# EAGLE schematic distance (EAGLE 7.5.0)
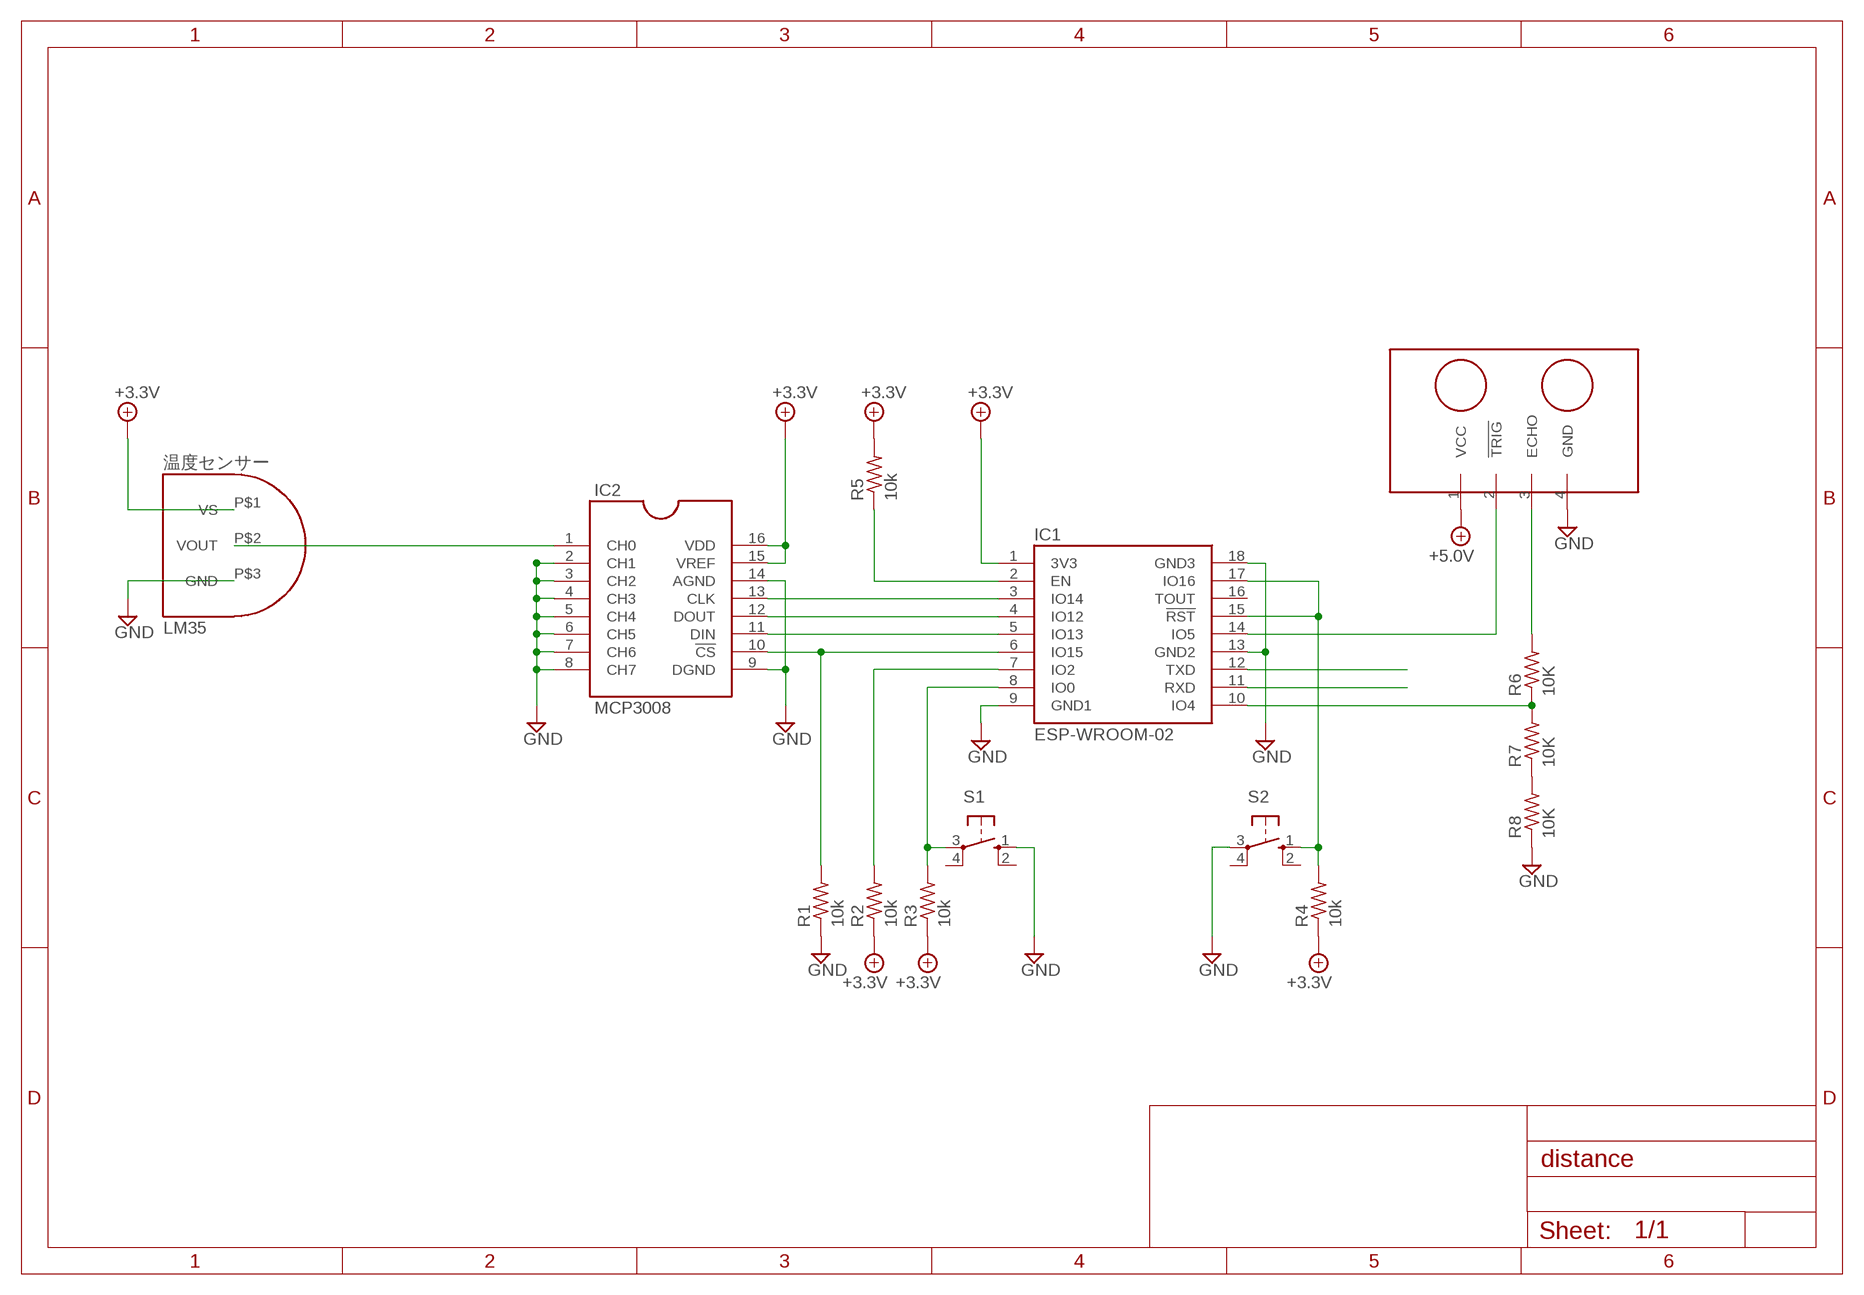
[diagram p0: schematic, sheet 1]

## Parts
IC1  ESP-WROOM-02  [WROOM-02]
IC2  MCP3008  [DIL16]
R1  10k  R  [0309/12]
R2  10k  R  [0309/12]
R3  10k  R  [0309/12]
R4  10k  R  [0309/12]
R5  10k  R  [0309/12]
R6  10K  R  [0309/12]
R7  10K  R  [0309/12]
R8  10K  R  [0309/12]
S1  10-XX(タクトスイッチ)  [B3F-10XX]
S2  10-XX(タクトスイッチ)  [B3F-10XX]
U$1  HC-SR04(距離センサー)  [HC-SR04(距離センサー)]
温度センサー  LM35  [LM35]

## Nets
+3.3V: IC1.1(3V3) IC2.15(VREF) IC2.16(VDD) R2.1 R3.1 R4.1 R5.2 U$1.1(VCC) 温度センサー.P$1(VS) ; supply symbol labelled +5.0V
GND: IC1.9(GND1) IC1.13(GND2) IC1.18(GND3) IC2.2(CH1) IC2.3(CH2) IC2.4(CH3) IC2.5(CH4) IC2.6(CH5) IC2.7(CH6) IC2.8(CH7) IC2.9(DGND) IC2.14(AGND) R1.1 R8.1 S1.1(S) S2.3(P) U$1.4(GND) 温度センサー.P$3(GND)
N$1: IC1.6(IO15) IC2.10(!CS!) R1.2
N$2: IC1.5(IO13) IC2.11(DIN)
N$3: IC1.4(IO12) IC2.12(DOUT)
N$4: IC1.15(!RST!) IC1.17(IO16) R4.2 S2.1(S)
N$5: IC1.7(IO2) R2.2
N$7: IC1.12(TXD)
N$8: IC1.3(IO14) IC2.13(CLK)
N$9: IC1.11(RXD)
N$10: IC1.8(IO0) R3.2 S1.3(P)
N$11: IC2.1(CH0) 温度センサー.P$2(VOUT)
N$15: IC1.2(EN) R5.1
N$16: IC1.14(IO5) U$1.2(!TRIG!)
N$17: R7.1 R8.2
N$18: R6.2 U$1.3(ECHO)
R6: IC1.10(IO4) R6.1 R7.2
Unconnected: IC1.16(TOUT) S1.2(S1) S1.4(P1) S2.2(S1) S2.4(P1)

## Library data of the parts
IC1 = MyLibraries:ESP-WROOM-02: ESP8266 WROOM-02
IC2 = MyLibraries:MCP3008: Dual In Line / Socket
R1-R5 = MyLibraries:R
R6-R8 = distance:R: 抵抗
S1 S2 = MyLibraries:10-XX(タクトスイッチ): OMRON SWITCH 秋月電子 <http://akizukidenshi.com/catalog/g/gP-03648/>; MPN: B3F-1000; OC_FARNELL: 176432; OC_NEWARK: 36M3542
U$1 = distance:HC-SR04(距離センサー): 距離センサー
温度センサー = MyLibraries:LM35: 温度センサー